# EAGLE schematic Schematic (EAGLE 6.4)
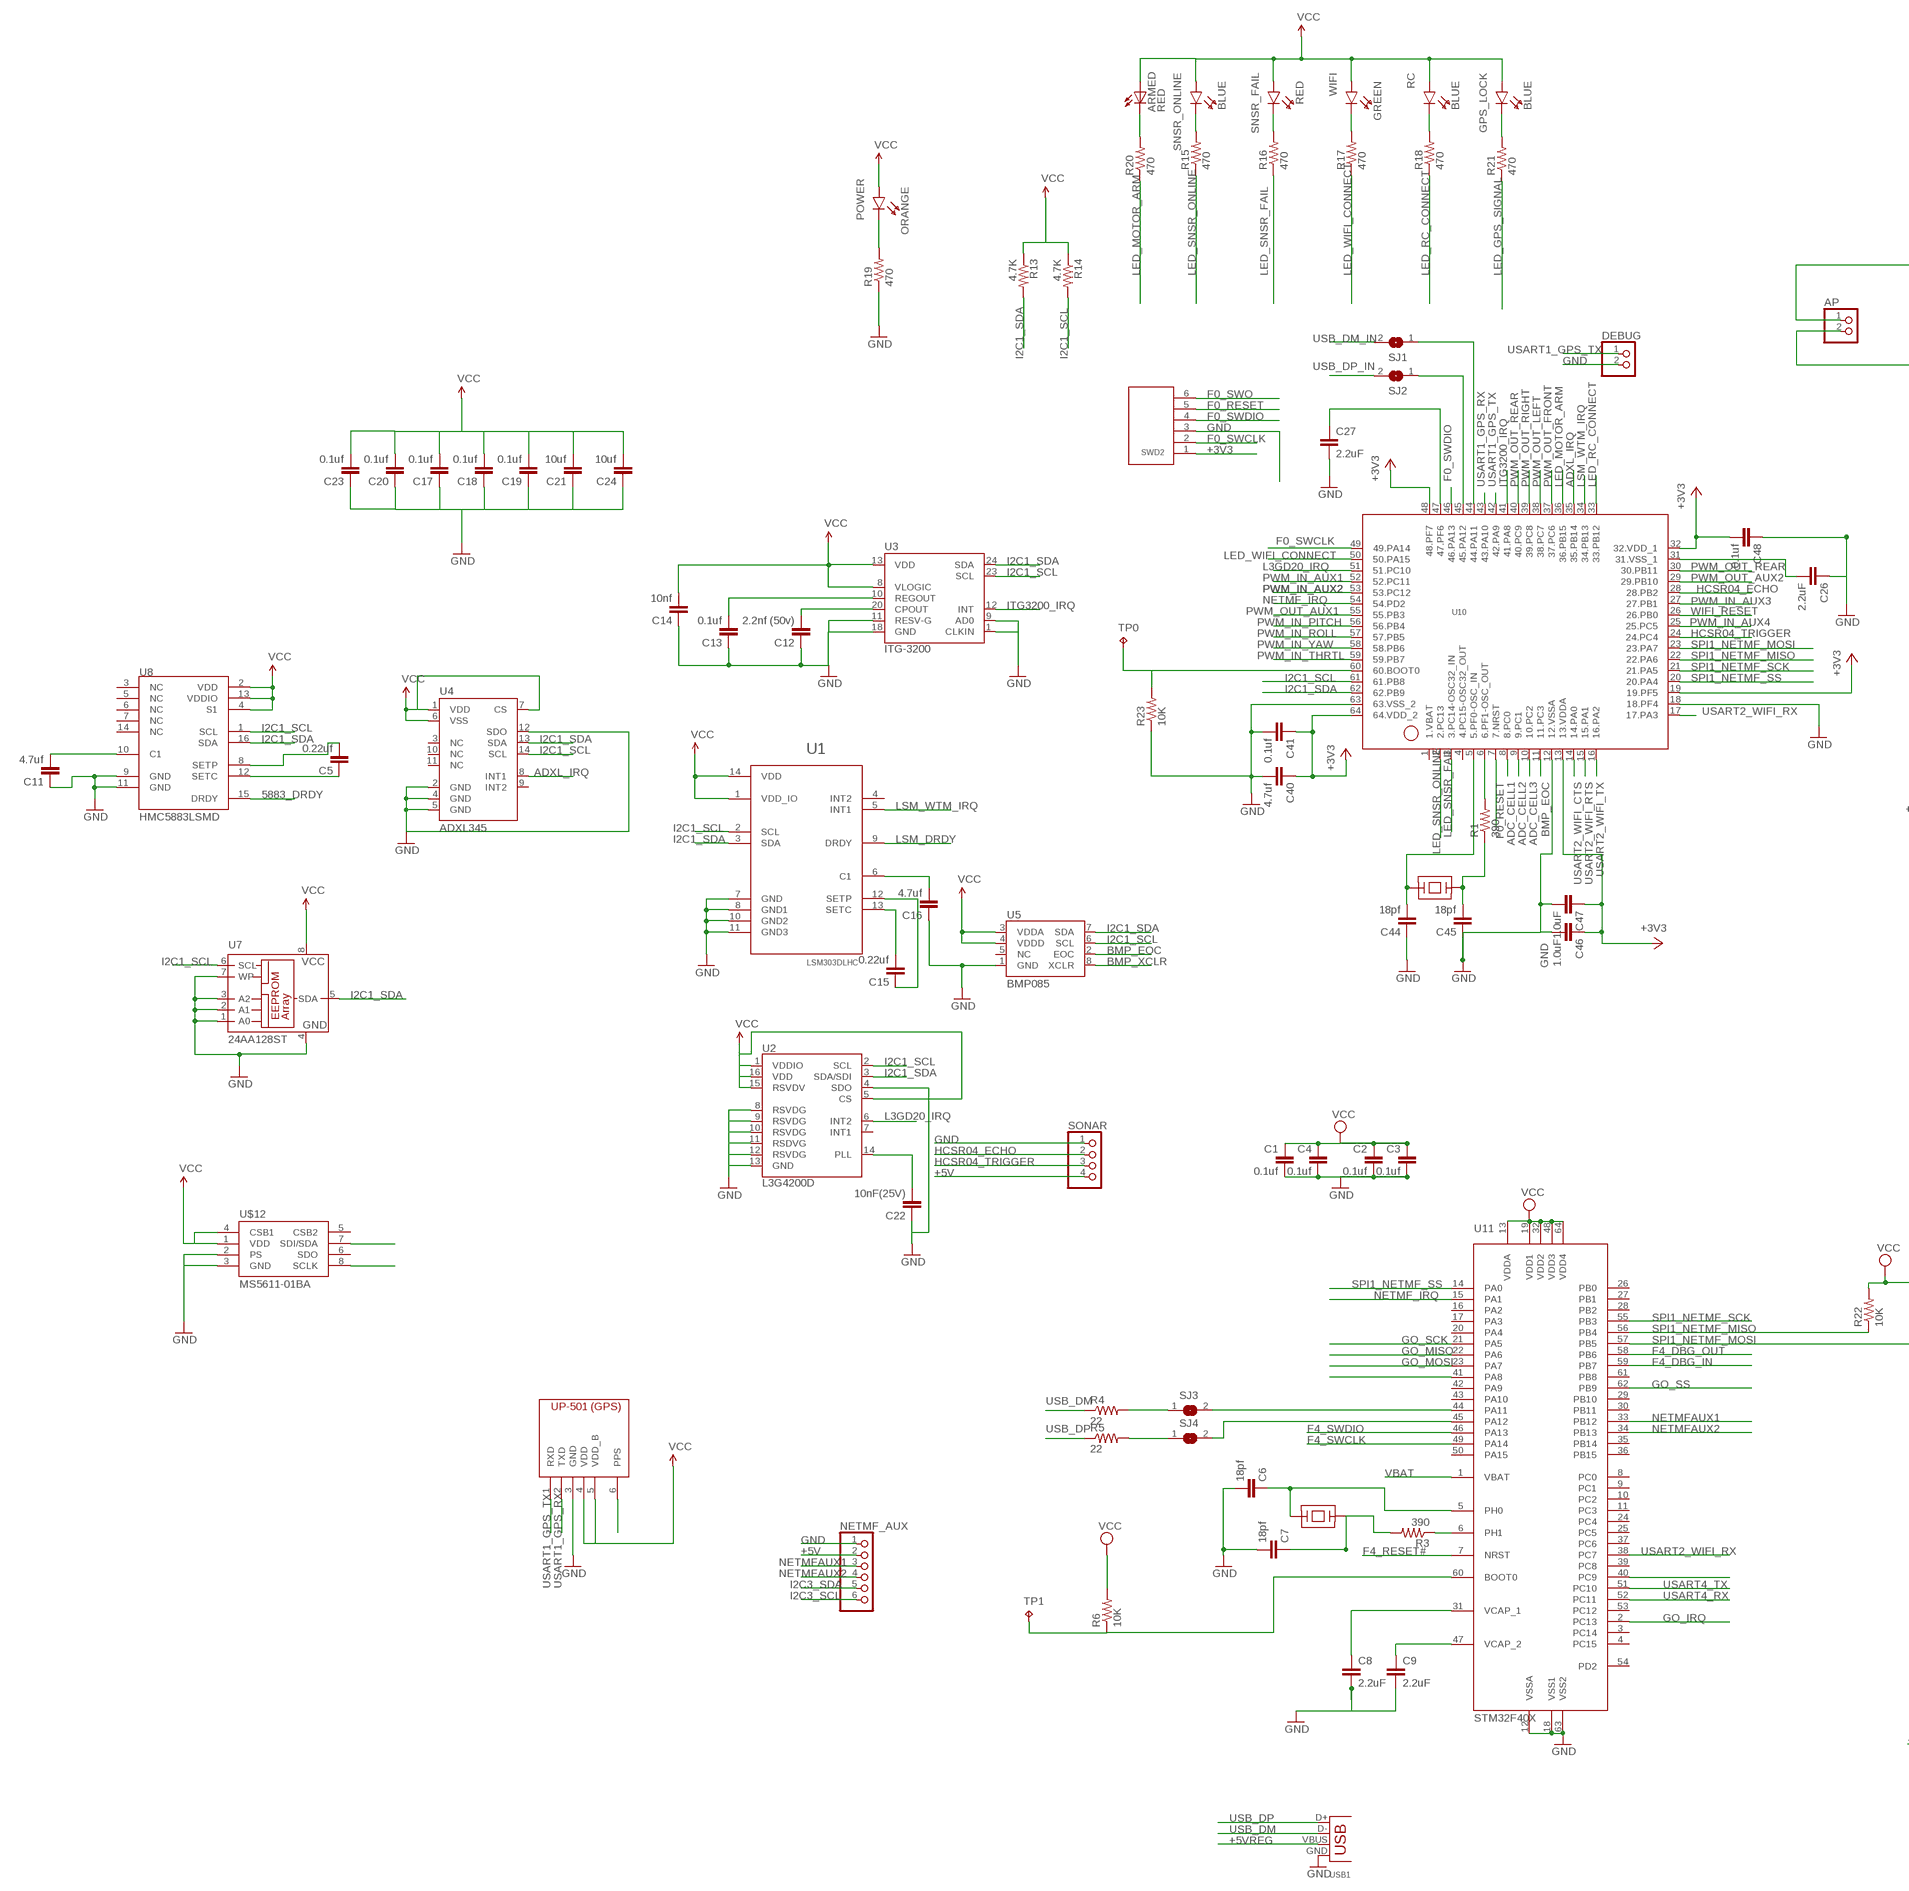
[diagram p0: schematic, sheet 1, part 1 of 2]
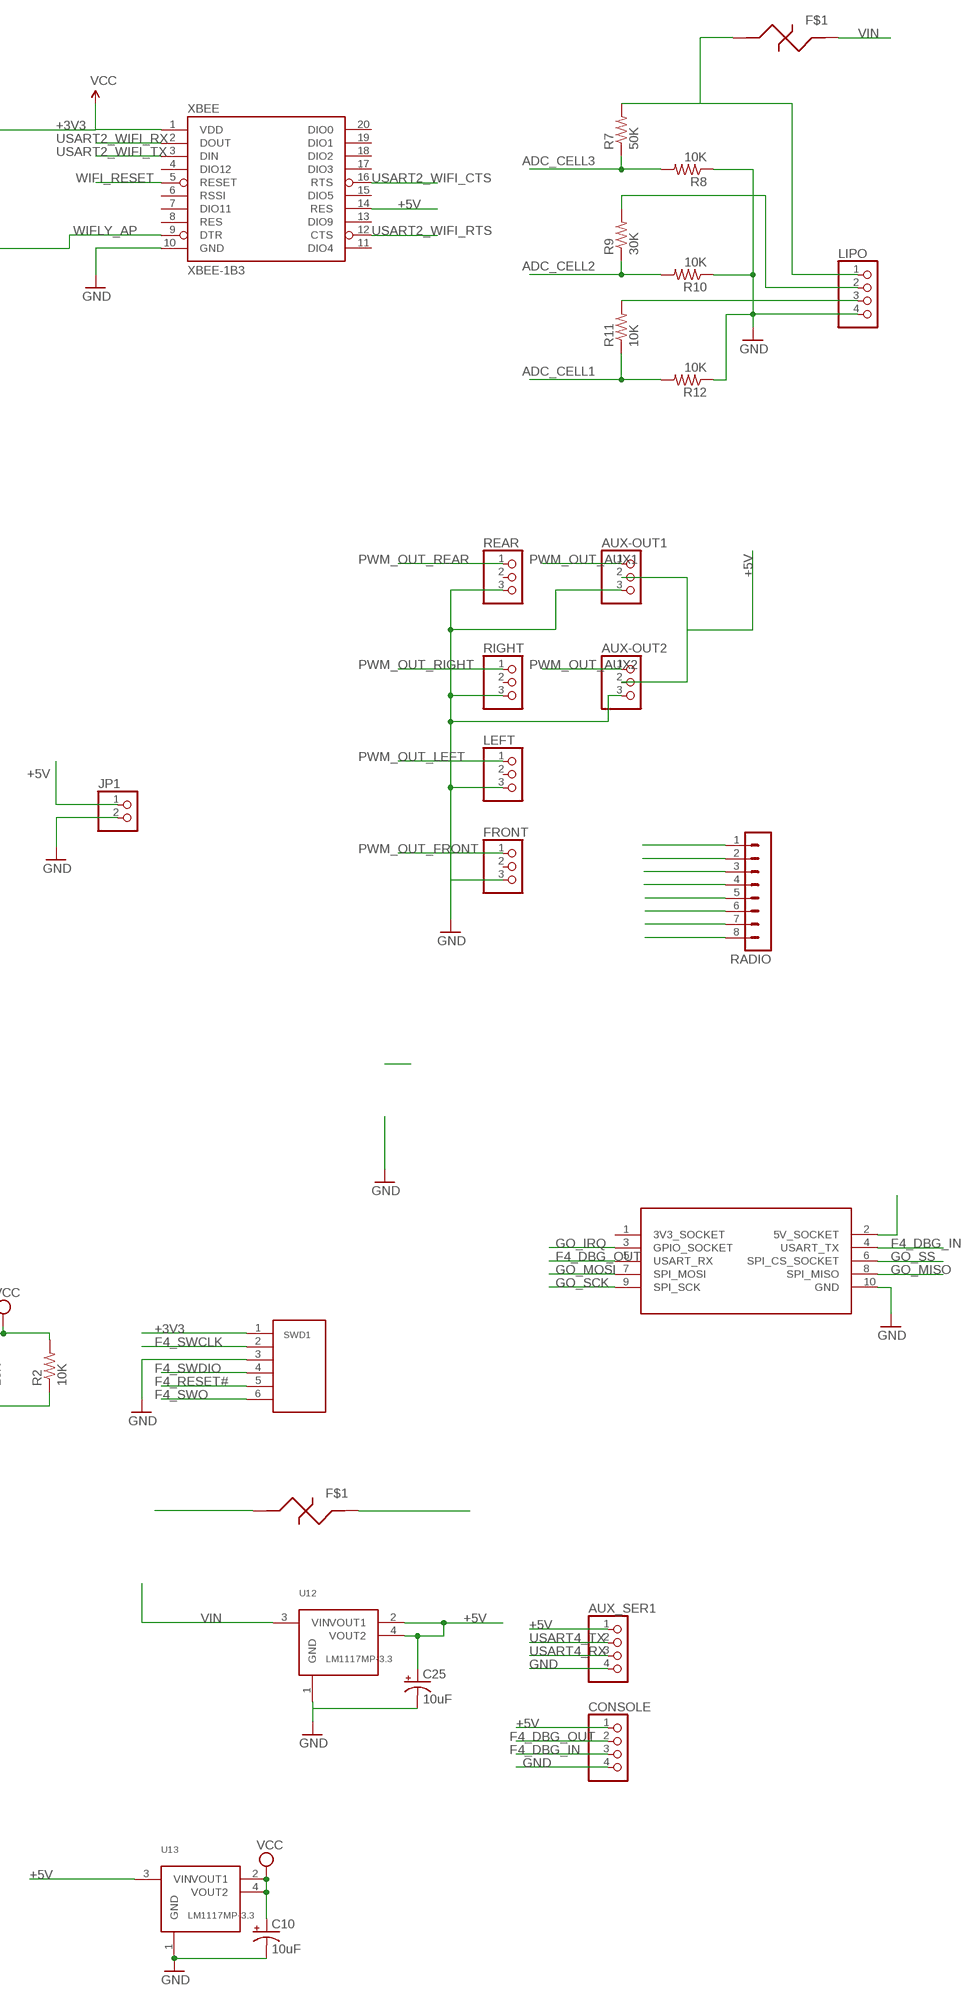
[diagram p1: schematic, sheet 1, part 2 of 2]

## Parts
AP  PINHD-1X2  [1X02]
ARMED  RED  LED-REDLILYPAD  [LED-1206]
AUX-OUT1  PINHD-1X3  [1X03]
AUX-OUT2  PINHD-1X3  [1X03]
AUX_SER1  PINHD-1X4  [1X04]
C1  0.1uf  CAP0805  [0805]
C2  0.1uf  CAP0805  [0805]
C3  0.1uf  CAP0805  [0805]
C4  0.1uf  CAP0805  [0805]
C5  0.22uf  CAP0805  [0805]
C6  18pf  CAP0805  [0805]
C7  18pf  CAP0805  [0805]
C8  2.2uF  CAP0805  [0805]
C9  2.2uF  CAP0805  [0805]
C10  10uF  CPOL-USCT3528  [CT3528]
C11  4.7uf  CAP0805  [0805]
C12  2.2nf (50v)  CAP0805  [0805]
C13  0.1uf  CAP0805  [0805]
C14  10nf  CAP0805  [0805]
C15  0.22uf  CAP0805  [0805]
C16  4.7uf  CAP0805  [0805]
C17  0.1uf  CAP0805  [0805]
C18  0.1uf  CAP0805  [0805]
C19  0.1uf  CAP0805  [0805]
C20  0.1uf  CAP0805  [0805]
C21  10uf  CAP0805  [0805]
C22  10nF(25V)  CAP0805  [0805]
C23  0.1uf  CAP0805  [0805]
C24  10uf  CAP0805  [0805]
C25  10uF  CPOL-USCT3528  [CT3528]
C26  2.2uF  CAP0805  [0805]
C27  2.2uF  CAP0805  [0805]
C40  4.7uf  CAP0805  [0805]
C41  0.1uf  CAP0805  [0805]
C44  18pf  CAP0805  [0805]
C45  18pf  CAP0805  [0805]
C46  1.0uF  CAP0805  [0805]
C47  1.0uF  CAP0805  [0805]
C48  0.1uf  CAP0805  [0805]
CONSOLE  PINHD-1X4  [1X04]
DEBUG  PINHD-1X2  [1X02]
F1  1206L050_FUSE  [1206L050_FUSE]
F2  1206L050_FUSE  [1206L050_FUSE]
FRONT  PINHD-1X3  [1X03]
GO_BUS  GO!BUS  [PIN2ROW_0.05"]
GPS_LOCK  BLUE  SMD_LED0805  [LED0805]
JP1  PINHD-1X2  [1X02]
LEFT  PINHD-1X3  [1X03]
LIPO  PINHD-1X4  [1X04]
NETMF_AUX  PINHD-1X6  [1X06]
POWER  ORANGE  SMD_LED0805  [LED0805]
R1  390  RESISTOR0805-RES  [0805]
R2  10K  RESISTOR0805-RES  [0805]
R3  390  RESISTOR0805-RES  [0805]
R4  22  RESISTOR0805-RES  [0805]
R5  22  RESISTOR0805-RES  [0805]
R6  10K  RESISTOR0805-RES  [0805]
R7  50K  RESISTOR0805-RES  [0805]
R8  10K  RESISTOR0805-RES  [0805]
R9  30K  RESISTOR0805-RES  [0805]
R10  10K  RESISTOR0805-RES  [0805]
R11  10K  RESISTOR0805-RES  [0805]
R12  10K  RESISTOR0805-RES  [0805]
R13  4.7K  RESISTOR0805-RES  [0805]
R14  4.7K  RESISTOR0805-RES  [0805]
R15  470  RESISTOR0805-RES  [0805]
R16  470  RESISTOR0805-RES  [0805]
R17  470  RESISTOR0805-RES  [0805]
R18  470  RESISTOR0805-RES  [0805]
R19  470  RESISTOR0805-RES  [0805]
R20  470  RESISTOR0805-RES  [0805]
R21  470  RESISTOR0805-RES  [0805]
R22  10K  RESISTOR0805-RES  [0805]
R23  10K  RESISTOR0805-RES  [0805]
RADIO  MA08-1  [MA08-1]
RC  BLUE  SMD_LED0805  [LED0805]
REAR  PINHD-1X3  [1X03]
RIGHT  PINHD-1X3  [1X03]
SJ1  SJ  [SJ]
SJ2  SJ  [SJ]
SJ3  SJ  [SJ]
SJ4  SJ  [SJ]
SNSR_FAIL  RED  SMD_LED0805  [LED0805]
SNSR_ONLINE  BLUE  SMD_LED0805  [LED0805]
SONAR  PINHD-1X4  [1X04]
SWD1  JST-6PIN  [JSTX6]
SWD2  SWD-STM32F0  JST-6PIN  [JSTX6]
TP0  TPTP15R  [TP15R]
TP1  TPTP15R  [TP15R]
U1  LSM303DLHC  [LGA3X5X1-14L]
U2  L3G4200D  [LGA16-4X4]
U3  ITG-3200  [QFN-24]
U4  ADXL345  [LGA14]
U5  BMP085  [BMP085]
U7  24AA128ST  [TSSOP8]
U8  HMC5883LSMD  [16LPCC]
U10  STM32F051XXX  [STM32F051XXX_LPFP64]
U11  STM32F40X  [LQFP64]
U12  LM1117MP-3.3  LM1117  [SOT223]
U13  LM1117MP-3.3  LM1117  [SOT223]
U$4  UP501  [UP-501]
U$12  MS5611-01BA  [MS5611-01BA]
USB1  DX2R005HN2E700  USB-MB-S  [USB-MB-S]
WIFI  GREEN  SMD_LED0805  [LED0805]
X1  ABRACON_ABM7  [ABRACON_ABM7_CERAMIC_XTAL]
X2  ABRACON_ABM7  [ABRACON_ABM7_CERAMIC_XTAL]
XBEE  XBEE-1B3  [XBEE-SMD]

## Nets
5883_DRDY: U8.15(DRDY)
+3V3: AP.1 ARMED.A C1.1 C2.1 C3.1 C4.1 C10.+ C14.2 C17.2 C18.2 C19.2 C20.2 C21.2 C23.2 C24.2 C40.1 C41.1 C46.1 C47.1 C48.2 GPS_LOCK.P$1(A) POWER.P$1(A) R2.2 R6.2 R13.1 R14.1 R22.2 RC.P$1(A) SNSR_FAIL.P$1(A) SNSR_ONLINE.P$1(A) SWD1.1 SWD2.1 U1.1(VDD_IO) U1.14(VDD) U2.1(VDDIO) U2.5(CS) U2.15(RSVDV) U2.16(VDD) U3.8(VLOGIC) U3.13(VDD) U4.1(VDD) U4.6(VSS) U4.7(CS) U5.3(VDDA) U5.4(VDDD) U7.8(VCC) U8.2(VDD) U8.4(S1) U8.13(VDDIO) U10.13(13.VDDA) U10.19(19.PF5) U10.32(32.VDD_1) U10.48(48.PF7) U10.64(64.VDD_2) U11.13(VDDA) U11.19(VDD1) U11.32(VDD2) U11.48(VDD3) U11.64(VDD4) U13.2(VOUT1) U13.4(VOUT2) U$4.4(VDD) U$4.5(VDD_B) U$12.1(VDD) U$12.4(CSB1) WIFI.P$1(A) XBEE.1(VDD) ; supply symbol labelled VCC
+5V: AUX-OUT1.2 AUX-OUT2.2 AUX_SER1.1 C25.+ CONSOLE.1 F1.P$2 GO_BUS.2(5V_SOCKET) JP1.1 NETMF_AUX.2 SONAR.4 U12.2(VOUT1) U12.4(VOUT2) U13.3(VIN) XBEE.14(RES)
+5VREG: F1.P$1 USB1.VBUS
ADC_CELL1: R11.1 R12.2 U10.8(8.PC0)
ADC_CELL2: R9.1 R10.2 U10.9(9.PC1)
ADC_CELL3: R7.1 R8.2 U10.10(10.PC2)
ADXL_IRQ: U4.8(INT1) U10.35(35.PB14)
BMP_EOC: U5.2(EOC) U10.11(11.PC3)
BMP_XCLR: U5.8(XCLR)
F0_RESET: SWD2.5 U10.7(7.NRST)
F0_SWCLK: SWD2.2 U10.49(49.PA14)
F0_SWDIO: SWD2.4 U10.46(46.PA13)
F0_SWO: SWD2.6
F4_DBG_IN: CONSOLE.3 GO_BUS.4(USART_TX) U11.59(PB7)
F4_DBG_OUT: CONSOLE.2 GO_BUS.5(USART_RX) U11.58(PB6)
F4_RESET#: SWD1.5 U11.7(NRST)
F4_SWCLK: SWD1.2 U11.49(PA14)
F4_SWDIO: SWD1.4 U11.46(PA13)
F4_SWO: SWD1.6
GND [power]: AUX-OUT1.3 AUX-OUT2.3 AUX_SER1.4 C1.2 C2.2 C3.2 C4.2 C6.2 C7.2 C8.2 C9.2 C10.- C11.1 C12.1 C13.1 C14.1 C16.1 C17.1 C18.1 C19.1 C20.1 C21.1 C22.1 C23.1 C24.1 C25.- C26.1 C27.2 C40.2 C41.2 C44.1 C45.1 C46.2 C47.2 C48.1 CONSOLE.4 DEBUG.2 FRONT.3 GO_BUS.10(GND) JP1.2 LEFT.3 LIPO.4 NETMF_AUX.1 R8.1 R10.1 R12.1 R19.1 R23.1 REAR.3 RIGHT.3 SONAR.1 SWD1.3 SWD2.3 U1.7(GND) U1.8(GND1) U1.10(GND2) U1.11(GND3) U2.4(SDO) U2.8(RSVDG) U2.9(RSVDG) U2.10(RSVDG) U2.11(RSDVG) U2.12(RSVDG) U2.13(GND) U3.1(CLKIN) U3.9(AD0) U3.11(RESV-G) U3.18(GND) U4.2(GND) U4.4(GND) U4.5(GND) U4.12(SDO) U5.1(GND) U7.1(A0) U7.2(A1) U7.3(A2) U7.4(GND) U7.7(WP) U8.9(GND) U8.11(GND) U10.12(12.VSSA) U10.18(18.PF4) U10.63(63.VSS_2) U11.12(VSSA) U11.18(VSS1) U11.63(VSS2) U12.1(GND) U13.1(GND) U$4.3(GND) U$12.2(PS) U$12.3(GND) USB1.GND XBEE.10(GND)
GO_IRQ: GO_BUS.3(GPIO_SOCKET) U11.2(PC13)
GO_MISO: GO_BUS.8(SPI_MISO) U11.22(PA6)
GO_MOSI: GO_BUS.7(SPI_MOSI) U11.23(PA7)
GO_SCK: GO_BUS.9(SPI_SCK) U11.21(PA5)
GO_SS: GO_BUS.6(SPI_CS_SOCKET) U11.62(PB9)
HCSR04_ECHO: SONAR.2 U10.28(28.PB2)
HCSR04_TRIGGER: SONAR.3 U10.24(24.PC4)
I2C1_SCL: R14.2 U1.2(SCL) U2.2(SCL) U3.23(SCL) U4.14(SCL) U5.6(SCL) U7.6(SCL) U8.1(SCL) U10.61(61.PB8) U$12.8(SCLK)
I2C1_SDA: R13.2 U1.3(SDA) U2.3(SDA/SDI) U3.24(SDA) U4.13(SDA) U5.7(SDA) U7.5(SDA) U8.16(SDA) U10.62(62.PB9) U$12.7(SDI/SDA)
I2C3_SCL: NETMF_AUX.6 U11.41(PA8)
I2C3_SDA: NETMF_AUX.5 U11.40(PC9)
ITG3200_IRQ: U3.12(INT) U10.41(41.PA8)
L3GD20_IRQ: U2.6(INT2) U10.51(51.PC10)
LED_GPS_SIGNAL: R21.1 U$4.6(PPS)
LED_MOTOR_ARM: R20.1 U10.36(36.PB15)
LED_RC_CONNECT: R18.1 U10.33(33.PB12)
LED_SNSR_FAIL: R16.1 U10.3(3.PC14-OSC32_IN)
LED_SNSR_ONLINE: R15.1 U10.2(2.PC13)
LED_WIFI_CONNECT: R17.1 U10.50(50.PA15)
LSM_DRDY: U1.9(DRDY)
LSM_WTM_IRQ: U1.5(INT1) U10.34(34.PB13)
N$1: C5.1 U8.12(SETC)
N$2: C9.1 U11.47(VCAP_2)
N$3: C8.1 U11.31(VCAP_1)
N$4: C5.2 U8.8(SETP)
N$5: R1.2 U10.6(6.PF1-OSC_OUT)
N$6: R3.1 U11.6(PH1)
N$7: C11.2 U8.10(C1)
N$8: C16.2 U1.6(C1)
N$9: R15.2 SNSR_ONLINE.C
N$10: C12.2 U3.20(CPOUT)
N$11: C13.2 U3.10(REGOUT)
N$12: C15.1 U1.12(SETP)
N$13: C15.2 U1.13(SETC)
N$14: R16.2 SNSR_FAIL.C
N$15: ARMED.C R20.2
N$16: LIPO.3 R11.2
N$17: LIPO.2 R9.2
N$18: R6.1 TP1.TP U11.60(BOOT0)
N$19: R17.2 WIFI.C
N$20: R18.2 RC.C
N$21: POWER.C R19.2
N$25: R23.2 TP0.TP U10.60(60.BOOT0)
N$27: C22.2 U2.14(PLL)
N$30: GPS_LOCK.C R21.2
N$31: C26.2 U10.31(31.VSS_1)
N$32: C27.1 U10.47(47.PF6)
NETMF_IRQ: U10.54(54.PD2) U11.15(PA1)
NETMFAUX1: NETMF_AUX.3 U11.33(PB12)
NETMFAUX2: NETMF_AUX.4 U11.34(PB13)
OSC_IN: C44.2 U10.5(5.PF0-OSC_IN) X2.P$1
OSC_OUT: C45.2 R1.1 X2.P$2
PWM_IN_AUX1: RADIO.5 U10.52(52.PC11)
PWM_IN_AUX2: RADIO.6 U10.53(53.PC12)
PWM_IN_AUX3: RADIO.7 U10.27(27.PB1)
PWM_IN_AUX4: RADIO.8 U10.25(25.PC5)
PWM_IN_PITCH: RADIO.1 U10.56(56.PB4)
PWM_IN_ROLL: RADIO.2 U10.57(57.PB5)
PWM_IN_THRTL: RADIO.3 U10.59(59.PB7)
PWM_IN_YAW: RADIO.4 U10.58(58.PB6)
PWM_OUT_AUX1: AUX-OUT1.1 U10.55(55.PB3)
PWM_OUT_AUX2: AUX-OUT2.1 U10.29(29.PB10)
PWM_OUT_FRONT: FRONT.1 U10.37(37.PC6)
PWM_OUT_LEFT: LEFT.1 U10.38(38.PC7)
PWM_OUT_REAR: REAR.1 U10.30(30.PB11) U10.40(40.PC9)
PWM_OUT_RIGHT: RIGHT.1 U10.39(39.PC8)
SPI1_NETMF_MISO: R22.1 U10.22(22.PA6) U11.56(PB4)
SPI1_NETMF_MOSI: R2.1 U10.23(23.PA7) U11.57(PB5)
SPI1_NETMF_SCK: U10.21(21.PA5) U11.55(PB3)
SPI1_NETMF_SS: U10.20(20.PA4) U11.14(PA0)
USART1_GPS_RX: U10.43(43.PA10) U$4.2(TXD)
USART1_GPS_TX: DEBUG.1 U10.42(42.PA9) U$4.1(RXD)
USART2_WIFI_CTS: U10.14(14.PA0) XBEE.16(RTS)
USART2_WIFI_RTS: U10.15(15.PA1) XBEE.12(CTS)
USART2_WIFI_RX: U10.17(17.PA3) U11.38(PC7) XBEE.2(DOUT)
USART2_WIFI_TX: U10.16(16.PA2) XBEE.3(DIN)
USART4_RX: AUX_SER1.3 U11.52(PC11)
USART4_TX: AUX_SER1.2 U11.51(PC10)
USB_DM: R4.1 USB1.D-
USB_DM_IN: R4.2 SJ1.2 SJ3.1
USB_DM_IN1: SJ3.2 U11.44(PA11)
USB_DM_IN2: SJ1.1 U10.44(44.PA11)
USB_DP: R5.1 USB1.D+
USB_DP_IN: R5.2 SJ2.2 SJ4.1
USB_DP_IN1: SJ4.2 U11.45(PA12)
USB_DP_IN2: SJ2.1 U10.45(45.PA12)
VBAT: U11.1(VBAT)
VIN: F2.P$2 U12.3(VIN)
VIN_PROTECTED: F2.P$1 LIPO.1 R7.2
WIFI_RESET: U10.26(26.PB0) XBEE.5(RESET)
WIFLY_AP: AP.2 XBEE.9(DTR)
XTAL3: C6.1 U11.5(PH0) X1.P$1
XTAL4: C7.1 R3.2 X1.P$2
Unconnected: FRONT.2 LEFT.2 REAR.2 RIGHT.2 U1.4(INT2) U2.7(INT1) U4.3(NC) U4.9(INT2) U4.10(NC) U4.11(NC) U5.5(NC) U8.3(NC) U8.5(NC) U8.6(NC) U8.7(NC) U8.14(NC) U10.1(1.VBAT) U10.4(4.PC15-OSC32_OUT) U11.3(PC14) U11.4(PC15) U11.8(PC0) U11.9(PC1) U11.10(PC2) U11.11(PC3) U11.16(PA2) U11.17(PA3) U11.20(PA4) U11.24(PC4) U11.25(PC5) U11.26(PB0) U11.27(PB1) U11.28(PB2) U11.29(PB10) U11.30(PB11) U11.35(PB14) U11.36(PB15) U11.37(PC6) U11.39(PC8) U11.42(PA9) U11.43(PA10) U11.50(PA15) U11.53(PC12) U11.54(PD2) U11.61(PB8) U$12.5(CSB2) U$12.6(SDO) XBEE.4(DIO12) XBEE.6(RSSI) XBEE.7(DIO11) XBEE.8(RES) XBEE.11(DIO4) XBEE.13(DIO9) XBEE.15(DIO5) XBEE.17(DIO3) XBEE.18(DIO2) XBEE.19(DIO1) XBEE.20(DIO0)

## Power pins joined to a net without a drawn wire
3V3_SOCKET: GO_BUS.1(3V3_SOCKET)

## Library data of the parts
AP DEBUG JP1 = pinhead:PINHD-1X2: PIN HEADER
ARMED = SparkFun-LED:LED-RED: Assorted Red LEDs LilyPad 1206- DIO-09912 1206- DIO-00809 0603- DIO-00819; PROD_ID: DIO-09912
AUX-OUT1 AUX-OUT2 FRONT LEFT REAR RIGHT = pinhead:PINHD-1X3: PIN HEADER
AUX_SER1 CONSOLE LIPO SONAR = pinhead:PINHD-1X4: PIN HEADER
C1-C4 C6-C9 C26 C27 C40 C41 C44-C48 = SparkFun-Passives:CAP: Capacitor Standard 0603 ceramic capacitor, and 0.1" leaded capacitor.
C5 C11-C24 = SparkFun:CAP: Capacitor Standard 0603 ceramic capacitor, and 0.1" leaded capacitor.
C10 C25 = rcl:CPOL-US: POLARIZED CAPACITOR, American symbol
F1 F2 = SoftwareLogisticsParts:1206L050_FUSE
GO_BUS = SoftwareLogisticsParts:GO!BUS
GPS_LOCK POWER RC SNSR_FAIL SNSR_ONLINE WIFI = SoftwareLogisticsParts:SMD_LED0805
NETMF_AUX = pinhead:PINHD-1X6: PIN HEADER
R1-R23 = SparkFun-Passives:RESISTOR: Resistor Basic schematic elements and footprints for 0603, 1206, and PTH resistors.
RADIO = con-lstb:MA08-1: PIN HEADER; OC_FARNELL: unknown; OC_NEWARK: unknown
SJ1-SJ4 = jumper:SJ: SMD solder JUMPER
SWD1 SWD2 = SoftwareLogisticsParts:JST-6PIN
TP0 TP1 = testpad:TP: Test pad
U1 = SoftwareLogisticsParts (2):LSM303DLHC: 3D Accelerometer and 3D Magenetometer Module ST Micro Electronics
U2 = SparkFun:L3G4200D: L3G4200D Three-axis, digital output gyroscope The L3G4200D is a low-power three-axis angular rate sensor, has a full scale of ±250/±500/±2000 dps and is capable of measuring rates with a user-selectable bandwidth. It includes a sensing element and an IC interface capable of providing the measured angular rate to the external world through a digital interface (I2C/SPI). Package: 4x4x1.1 LGA-16 (LGA16-4x4.PAC)
U3 = SparkFun:ITG-3200: ITG-3200 3-axis gyro, digital output, qfn24 package
U4 = SparkFun:ADXL345
U5 = SparkFun:BMP085: BMP085 Pressure Sensor Great little MEMS pressure sensor. SKU: COM-09603
U7 = microchip:24*: Serial EEPROM I2C; MF: MICROCHIP; MPN: 24AA128-I/ST; OC_FARNELL: unknown; OC_NEWARK: 92C6843
U8 = SparkFun:HMC5883L: 3 Axis Digital Compass IC
U10 = Nwazet.Go:STM32F051XXX
U11 = GHI:STM32F40X
U12 U13 = GHI:LM1117
U$4 = SoftwareLogisticsParts (2):UP501
U$12 = 3DRobotics:MS5611-01BA: MS5611-01BA The MS5611-01BA is a new generation of high resolution altimeter sensors from MEAS Switzerland with SPI and I 2 C bus interface. It is optimized for altimeters and variometers with an altitude resolution of 10 cm. The sensor module includes a high linearity pressure sensor and an ultra low power 24 bit ?? ADC with internal factory calibrated coefficients. It provides a precise digital 24 Bit pressure and temperature value and different operation modes that allow the user to optimize for conversion speed and current consumption. A high resolution temperature output allows the implementation of an altimeter/thermometer function without any additional sensor. The MS5611-01BA can be interfaced to virtually any microcontroller. The communication protocol is simple, without the need of programming internal registers in the device. Small dimensions of only 5.0 mm x 3.0 mm and a height of 1.7 mm allow for integration in mobile devices. This new sensor module generation is based on leading MEMS technology and latest benefits from MEAS Switzerland proven experience and know-how in high volume manufacturing of altimeter modules, which have been widely used for over a decade. The sensing principle employed leads to very low hysteresis and high stability of both pressure and temperature signal. High resolution module, 10 cm Fast conversion down to 1 ms Low power, 1 µA (standby < 0.15 µA) QFN package 5.0 x 3.0 x 1.7 mm3 Supply voltage 1.8 to 3.6 V Integrated digital pressure sensor (24 bit ?? ADC) Operating range: 10 to 1200 mbar, -40 to +85 °C I2C and SPI interface up to 20 MHz No external components (Internal oscillator) Excellent long term stability; DATASHEET: http://www.meas-spec.com/downloads/MS5611-01BA01.pdf; LINK: http://www.meas-spec.com/product/t_product.aspx?id=8503#; MFGPN: MS5611-01BA
USB1 = con-usb-3:USB: USB Connectors
X1 X2 = Nwazet.Go:ABRACON_ABM7
XBEE = SparkFun-RF:XBEE-1: Xbee module footprints